# EAGLE design Girlfriend Tracker V0.2 (EAGLE 8.7.0)
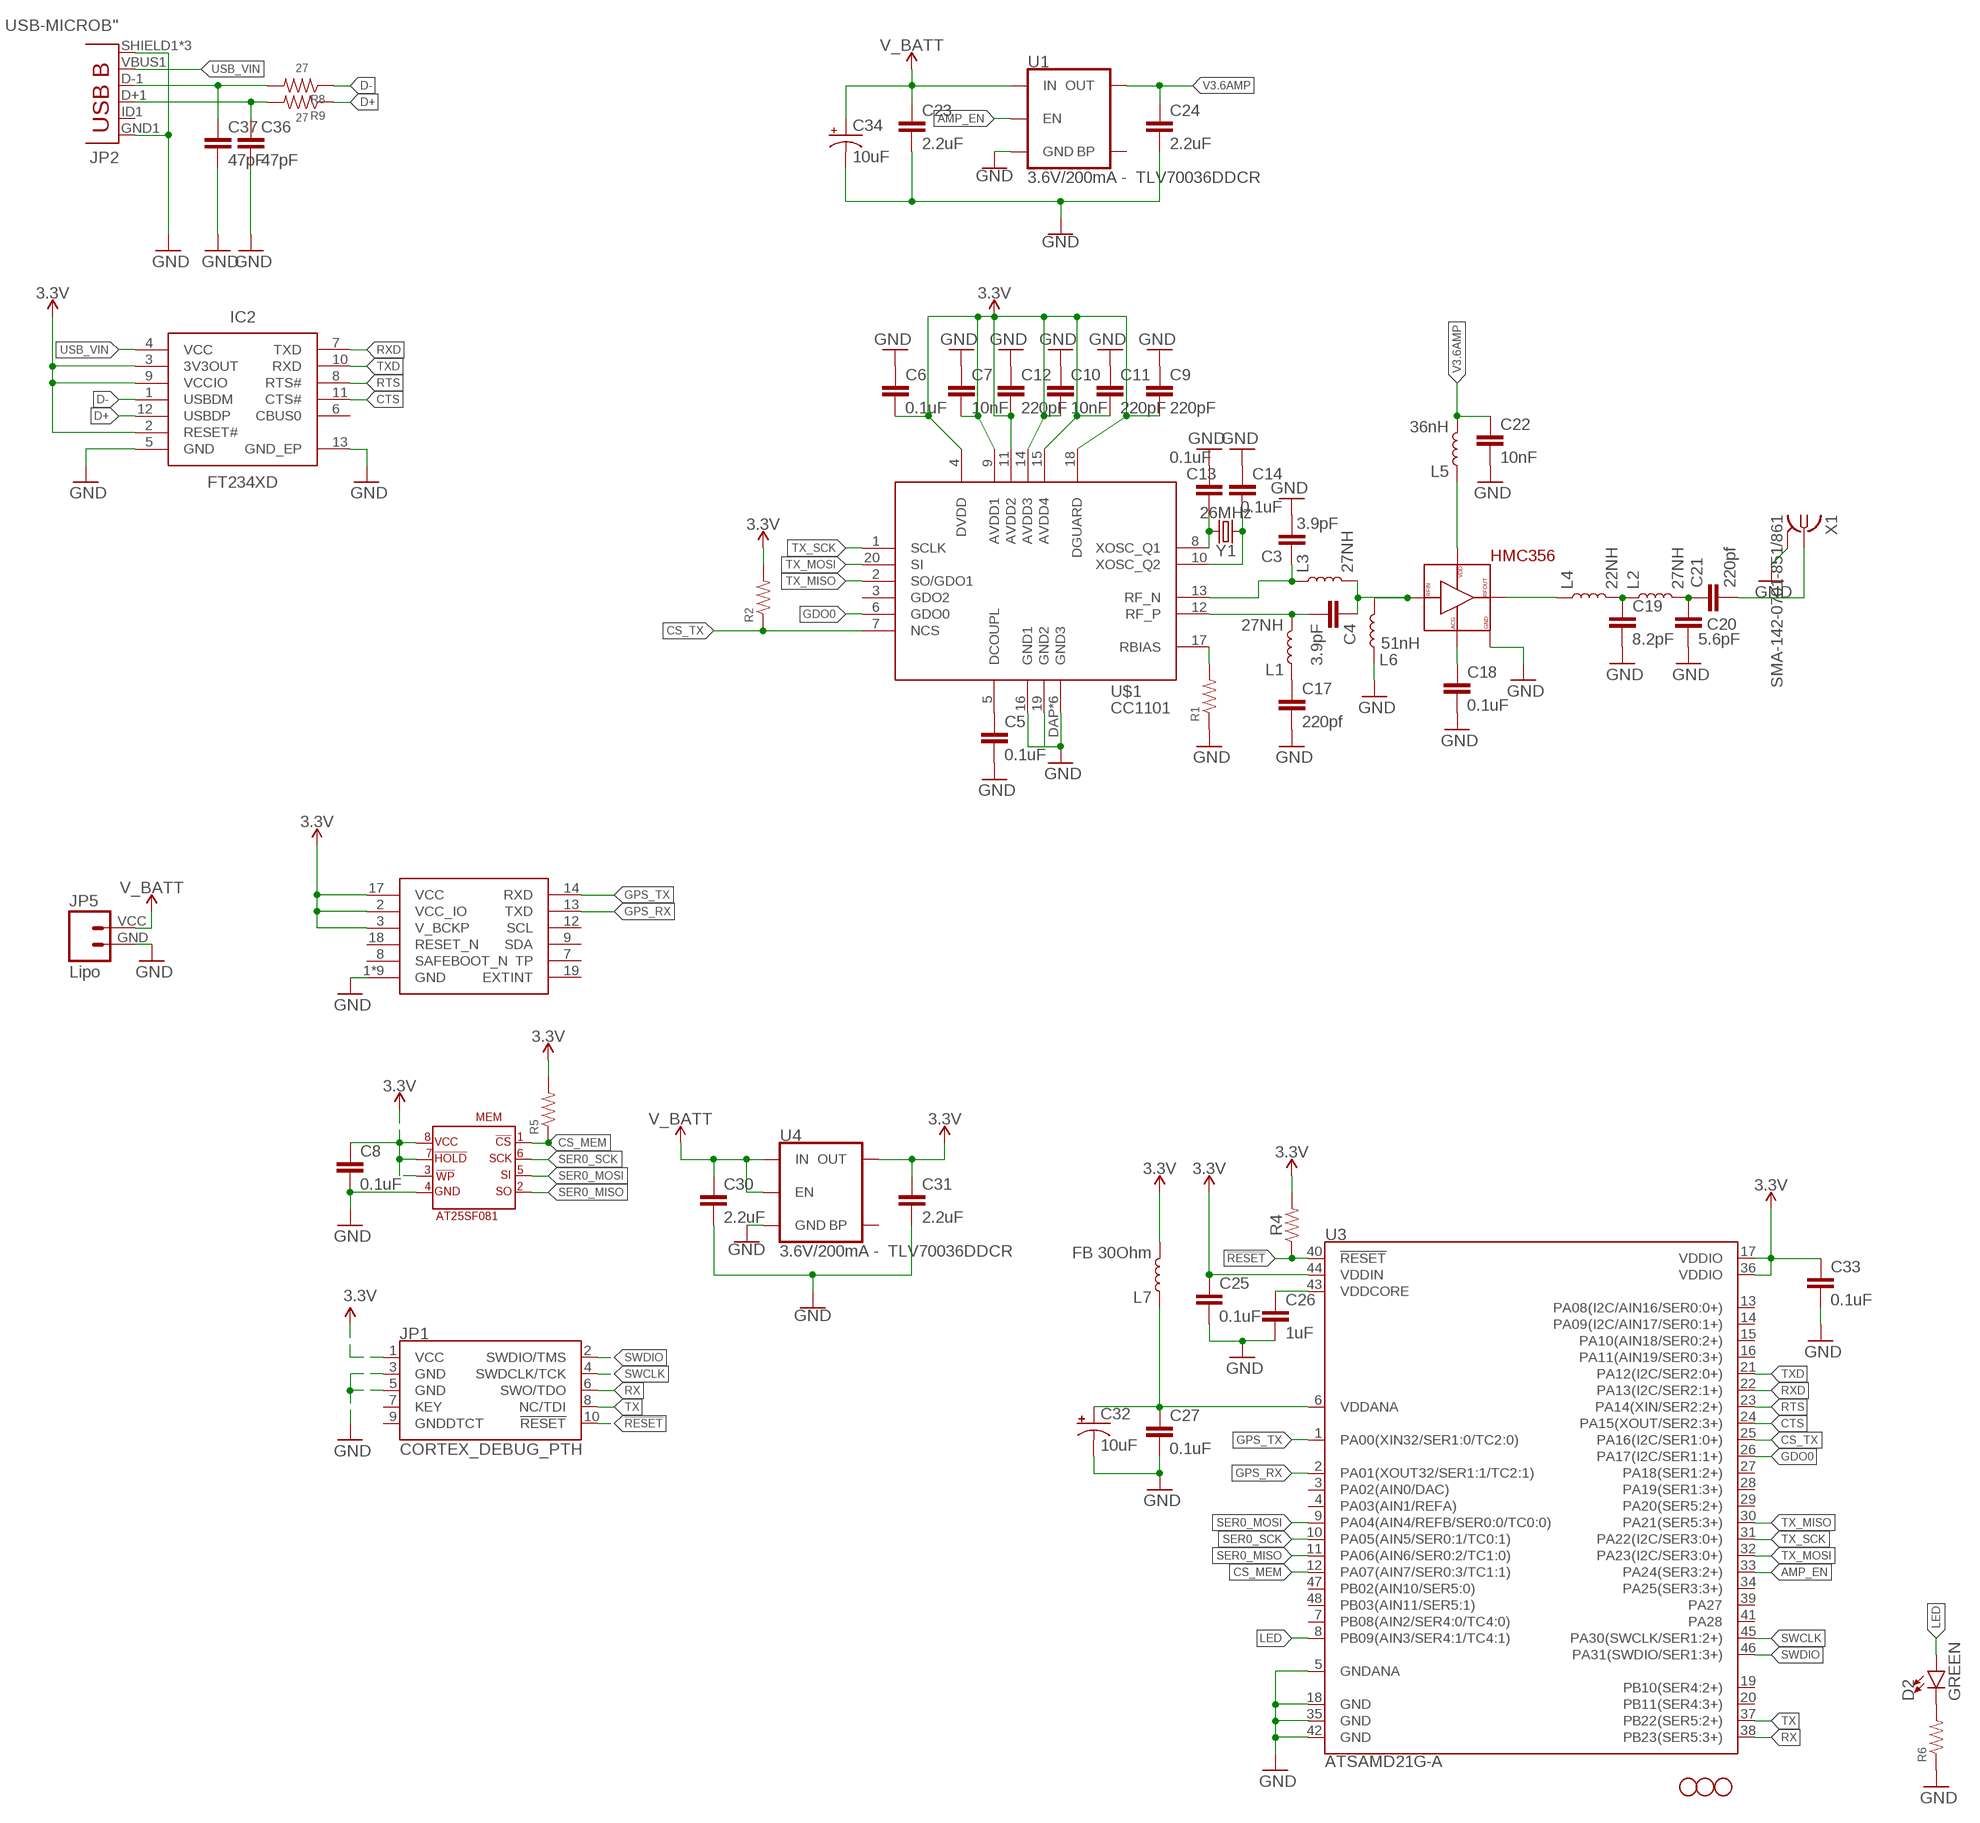
[diagram p0: schematic, sheet 1]

## Parts
C3  3.9pF  0.1UF-0402-16V-10%  [0402]
C4  3.9pF  0.1UF-0402-16V-10%  [0402]
C5  0.1uF  0.1UF-0402-16V-10%  [0402]
C6  0.1uF  0.1UF-0402-16V-10%  [0402]
C7  10nF  0.1UF-0402-16V-10%  [0402]
C8  0.1uF  0.1UF-0402-16V-10%  [0402]
C9  220pF  0.1UF-0402-16V-10%  [0402]
C10  10nF  0.1UF-0402-16V-10%  [0402]
C11  220pF  0.1UF-0402-16V-10%  [0402]
C12  220pF  0.1UF-0402-16V-10%  [0402]
C13  0.1uF  0.1UF-0402-16V-10%  [0402]
C14  0.1uF  0.1UF-0402-16V-10%  [0402]
C17  220pf  0.1UF-0402-16V-10%  [0402]
C18  0.1uF  0.1UF-0402-16V-10%  [0402]
C19  8.2pF  0.1UF-0402-16V-10%  [0402]
C20  5.6pF  0.1UF-0402-16V-10%  [0402]
C21  220pf  0.1UF-0402-16V-10%  [0402]
C22  10nF  0.1UF-0402-16V-10%  [0402]
C23  2.2uF  2.2UF-0603-10V-20%  [0603]
C24  2.2uF  2.2UF-0603-10V-20%  [0603]
C25  0.1uF  0.1UF-0402-16V-10%  [0402]
C26  1uF  0.1UF-0402-16V-10%  [0402]
C27  0.1uF  0.1UF-0402-16V-10%  [0402]
C30  2.2uF  2.2UF-0603-10V-20%  [0603]
C31  2.2uF  2.2UF-0603-10V-20%  [0603]
C32  10uF  CAP_POL1206  [EIA3216]
C33  0.1uF  0.1UF-0402-16V-10%  [0402]
C34  10uF  CAP_POL1206  [EIA3216]
C36  47pF  0.1UF-0402-16V-10%  [0402]
C37  47pF  0.1UF-0402-16V-10%  [0402]
D2  GREEN  LED-GREEN1206  [LED-1206]
H1  STAND-OFFTIGHT  [STAND-OFF-TIGHT]
H2  STAND-OFFTIGHT  [STAND-OFF-TIGHT]
H3  STAND-OFFTIGHT  [STAND-OFF-TIGHT]
IC1  SAM-M8Q  [SAM-M8Q]
IC2  FT234XD  [SON45P300X300X80-13N]
JP1  CORTEX_DEBUG_PTH  [2X5-PTH-1.27MM]
JP2  USB-MICROB"  [USB-B-MICRO-SMD_V03]
JP5  Lipo  M024UCON-15767  [JST-2-SMD-VERT]
L1  27NH  INDUCTOR-0402-3.9NH  [0402]
L2  27NH  INDUCTOR-0402-3.9NH  [0402]
L3  27NH  INDUCTOR-0402-3.9NH  [0402]
L4  22NH  INDUCTOR-0402-3.9NH  [0402]
L5  36nH  INDUCTOR-0402-3.9NH  [0402]
L6  51nH  INDUCTOR-0402-3.9NH  [0402]
L7  FB 30Ohm  INDUCTOR-0603-33NH  [0603]
MEM  AT25SF081  [AT25SF081]
R1  RESISTOR0402  [0402]
R2  RESISTOR0402  [0402]
R4  RESISTOR0402  [0402]
R5  RESISTOR0402  [0402]
R6  RESISTOR0402  [0402]
R8  27  RESISTOR0402  [0402]
R9  27  RESISTOR0402  [0402]
U1  3.6V/200mA - TLV70036DDCR  V_REG_MIC52053.3V  [SOT23-5]
U3  ATSAMD21G-A  [TQFP-48]
U4  3.6V/200mA - TLV70036DDCR  V_REG_MIC52053.3V  [SOT23-5]
U$1  CC1101  [CC1101]
U$3  HMC356  [QFN16_HMC356]
X1  SMA-142-0701-851/861  [J502-ND-142-0701-851/861]
Y1  26MHz  CRYSTALSMD-3.2X2.5  [CRYSTAL-SMD-3.2X2.5MM]

## Nets
3.3V: C6.2 C7.2 C8.1 C9.2 C10.2 C11.2 C12.2 C25.1 C31.1 C33.1 IC1.2(VCC_IO) IC1.3(V_BCKP) IC1.17(VCC) IC2.2(RESET#) IC2.3(3V3OUT) IC2.9(VCCIO) JP1.1(VCC) L7.2 MEM.!HOLD MEM.!WP MEM.VCC R2.2 R4.2 R5.2 U3.17(VDDIO) U3.36(VDDIO) U3.44(VDDIN) U4.5(OUT) U$1.4(DVDD) U$1.9(AVDD1) U$1.11(AVDD2) U$1.14(AVDD3) U$1.15(AVDD4) U$1.18(DGUARD)
!RESET: JP1.10(!RESET) R4.1 U3.40(!RESET!)
AMP_EN: U1.3(EN) U3.33(PA24(SER3:2+))
CS_MEM: MEM.!CS R5.1 U3.12(PA07(AIN7/SER0:3/TC1:1))
CS_TX: R2.1 U3.25(PA16(I2C/SER1:0+)) U$1.7(NCS)
CTS: IC2.11(CTS#) U3.24(PA15(XOUT/SER2:3+))
D+: IC2.12(USBDP) R9.1
D-: IC2.1(USBDM) R8.1
GDO0: U3.26(PA17(I2C/SER1:1+)) U$1.6(GDO0)
GND: C3.2 C5.2 C6.1 C7.1 C8.2 C9.1 C10.1 C11.1 C12.1 C13.1 C14.2 C17.2 C18.2 C19.2 C20.2 C22.2 C23.2 C24.2 C25.2 C26.2 C27.2 C30.2 C31.2 C32.C(-) C33.2 C34.C(-) C36.2 C37.2 IC1.1(GND) IC1.4(GND) IC1.5(GND) IC1.6(GND) IC1.10(GND) IC1.11(GND) IC1.15(GND) IC1.16(GND) IC1.20(GND) IC2.5(GND) IC2.13(GND_EP) JP1.3(GND) JP1.5(GND) JP2.GND1(GND) JP2.SHIELD1(SHIELD) JP2.SHIELD2(SHIELD) JP2.SHIELD3(SHIELD) JP5.GND L6.1 MEM.GND R1.1 R6.1 U1.2(GND) U3.5(GNDANA) U3.18(GND) U3.35(GND) U3.42(GND) U4.2(GND) U$1.16(GND1) U$1.19(GND2) U$1.DAP(GND3) U$1.P$1(GND3) U$1.P$2(GND3) U$1.P$3(GND3) U$1.P$4(GND3) U$1.P$5(GND3) U$3.P$2 U$3.P$4 U$3.P$6 U$3.P$16 U$3.P$17 U$3.P$17_1 U$3.P$17_2 U$3.P$17_3 U$3.P$17_4 X1.G@1 X1.G@2 X1.G@3 X1.G@4
GPS_RX: IC1.13(TXD) U3.2(PA01(XOUT32/SER1:1/TC2:1))
GPS_TX: IC1.14(RXD) U3.1(PA00(XIN32/SER1:0/TC2:0))
LED: D2.A U3.8(PB09(AIN3/SER4:1/TC4:1))
N$1: C17.1 L1.1
N$2: C36.1 JP2.D+1(D+) R9.2
N$3: C19.1 L2.1 L4.2
N$4: C13.2 U$1.8(XOSC_Q1) Y1.3
N$5: C20.1 C21.1 L2.2
N$6: C5.1 U$1.5(DCOUPL)
N$7: R1.2 U$1.17(RBIAS)
N$8: C18.1 U$3.P$7
N$9: C21.2 X1.1
N$10: L5.1 U$3.P$15
N$11: C4.1 L3.2 L6.2 U$3.P$3
N$12: C26.1 U3.43(VDDCORE)
N$13: C27.1 C32.A(+) L7.1 U3.6(VDDANA)
N$16: L4.1 U$3.P$11
N$17: C37.1 JP2.D-1(D-) R8.2
N$20: C14.1 U$1.10(XOSC_Q2) Y1.1
N$29: D2.C R6.2
RF_N: C3.1 L3.1 U$1.13(RF_N)
RF_P: C4.2 L1.2 U$1.12(RF_P)
RTS: IC2.8(RTS#) U3.23(PA14(XIN/SER2:2+))
RX: JP1.6(SWO/TDO) U3.38(PB23(SER5:3+))
RXD: IC2.7(TXD) U3.22(PA13(I2C/SER2:1+))
SER0_MISO: MEM.SO U3.11(PA06(AIN6/SER0:2/TC1:0))
SER0_MOSI: MEM.SI U3.9(PA04(AIN4/REFB/SER0:0/TC0:0))
SER0_SCK: MEM.SCK U3.10(PA05(AIN5/SER0:1/TC0:1))
SWCLK: JP1.4(SWDCLK/TCK) U3.45(PA30(SWCLK/SER1:2+))
SWDIO: JP1.2(SWDIO/TMS) U3.46(PA31(SWDIO/SER1:3+))
TX: JP1.8(NC/TDI) U3.37(PB22(SER5:2+))
TX_MISO: U3.30(PA21(SER5:3+)) U$1.2(SO/GDO1)
TX_MOSI: U3.32(PA23(I2C/SER3:0+)) U$1.20(SI)
TX_SCK: U3.31(PA22(I2C/SER3:0+)) U$1.1(SCLK)
TXD: IC2.10(RXD) U3.21(PA12(I2C/SER2:0+))
USB_VIN: IC2.4(VCC) JP2.VBUS1(VBUS)
V3.6AMP: C22.1 C24.1 L5.2 U1.5(OUT)
V_BATT: C23.1 C30.1 C34.A(+) JP5.VCC U1.1(IN) U4.1(IN) U4.3(EN)
Unconnected: IC1.7(TP) IC1.8(SAFEBOOT_N) IC1.9(SDA) IC1.12(SCL) IC1.18(RESET_N) IC1.19(EXTINT) IC2.6(CBUS0) JP1.7(KEY) JP1.9(GNDDTCT) JP2.ID1(USBID) U1.4(BP) U3.3(PA02(AIN0/DAC)) U3.4(PA03(AIN1/REFA)) U3.7(PB08(AIN2/SER4:0/TC4:0)) U3.13(PA08(I2C/AIN16/SER0:0+)) U3.14(PA09(I2C/AIN17/SER0:1+)) U3.15(PA10(AIN18/SER0:2+)) U3.16(PA11(AIN19/SER0:3+)) U3.19(PB10(SER4:2+)) U3.20(PB11(SER4:3+)) U3.27(PA18(SER1:2+)) U3.28(PA19(SER1:3+)) U3.29(PA20(SER5:2+)) U3.34(PA25(SER3:3+)) U3.39(PA27) U3.41(PA28) U3.47(PB02(AIN10/SER5:0)) U3.48(PB03(AIN11/SER5:1)) U4.4(BP) U$1.3(GDO2)

## Library data of the parts
C3 C4 C7 C9-C12 C17 C19-C22 C26 C36 C37 = SparkFun-Capacitors:0.1UF: 0.1µF ceramic capacitors A capacitor is a passive two-terminal electrical component used to store electrical energy temporarily in an electric field.; PROD_ID: CAP-12416; VALUE: 0.1uF
C5 C6 C8 C13 C14 C18 C25 C27 C33 = SparkFun-Capacitors:0.1UF: 0.1µF ceramic capacitors A capacitor is a passive two-terminal electrical component used to store electrical energy temporarily in an electric field.; PROD_ID: CAP-12416
C23 C24 C30 C31 = SparkFun-Capacitors:2.2UF: 2.2µF ceramic capacitors A capacitor is a passive two-terminal electrical component used to store electrical energy temporarily in an electric field.; PROD_ID: CAP-07888
C32 C34 = SparkFun:CAP_POL: Capacitor Polarized These are standard SMD and PTH capacitors. Normally 10uF, 47uF, and 100uF in electrolytic and tantalum varieties. Always verify the external diameter of the through hole cap, it varies with capacity, voltage, and manufacturer. The EIA devices should be standard.
D2 = SparkFun-LED:LED-GREEN: Green SMD LED Used in manufacturing of various products at SparkFun Packages: 0603 - SMD 0603 package [Product Link] <http://www.futureelectronics.com/en/technologies/semiconductors/optoelectronics/leds/Pages/9894312-LTST-C190GKT.aspx?CrossPart=HSMG-C190&IM=0> LilyPad 1206 - SMD1206 LilyPad package [Product Link] <http://www.futureelectronics.com/en/Technologies/Product.aspx?ProductID=IN150NGHARVATEKCORPORATION2049943&IM=0> 1206 - SMD1206 package [Product Link] <http://www.futureelectronics.com/en/technologies/semiconductors/optoelectronics/leds/Pages/8315665-LTST-C150KGKT.aspx?IM=0> 1206 Bottom Mount -SMD 1206 Bottom Mount [Product Link] <http://www.digikey.com/product-detail/en/lite-on-inc/LTST-C230KGKT/160-1456-1-ND/386854> SparkFun Products: Pro Mini 328 -5V <https://www.sparkfun.com/products/821> RedBoard <https://www.sparkfun.com/products/12757> MP3 Trigger <https://www.sparkfun.com/products/13720> Makey Makey <https://www.sparkfun.com/products/11076>; PROD_ID: DIO-00862
H1-H3 = SparkFun-Hardware:STAND-OFF: Stand Off Drill holes for mechanically mounting via screws, standoffs, etc. Note: Use the keepout ring to avoid running the screw head into surrounding components. Variant Overviews STAND-OFF - Mechanical footprint for a #4 phillips button head screw. STAND-OFF-TIGHT - Mechanical footprint for a #4 phillips button head screw, Example SparkFun Products Screw - Phillips Head (1/4", 4-40, 10 pack) <https://www.sparkfun.com/products/10453> (PRT-10453) Screw - Phillips Head (1/2", 4-40, 10 pack) <https://www.sparkfun.com/products/10452> (PRT-10452) Screw - Phillips Head (3/4", 4-40, 10 pack) <https://www.sparkfun.com/products/10451> (PRT-10451) Screw - Phillips Head (1", 4-40, 10 pack) <https://www.sparkfun.com/products/10450> (PRT-10450)
IC1 = ubloxLib:SAM-M8Q: u-blox SAM GNSS antenna module
IC2 = ft234xd:FT234XD: USB to serial UART Source: Datasheet <http://www.ftdichip.com/Support/Documents/DataSheets/ICs/DS_FT234XD.pdf>; DESCRIPTION: USB to serial UART; HEIGHT: 0.8mm; MANUFACTURER_NAME: FTDI Chip; MANUFACTURER_PART_NUMBER: ft234xd; SUPPLIER_NAME: RS
JP1 = SparkFun-Connectors:CORTEX_DEBUG: Cortex Debug Connector - 10 pin Supports JTAG debug, Serial Wire debug, and Serial Wire Viewer. PTH and SMD connector options available. General Connector Information <http://infocenter.arm.com/help/topic/com.arm.doc.faqs/attached/13634/cortex_debug_connectors.pdf> Products: PTH Connector <http://www.digikey.com/product-detail/en/cnc-tech/3220-10-0100-00/1175-1627-ND/3883661> -via Digi-Key SparkFun PSoc <https://www.sparkfun.com/products/13229> SparkFun T <https://www.sparkfun.com/products/13810>
JP2 = SparkFun-Connectors:USB-MICROB; PROD_ID: CONN-11752
JP5 = SparkFun-Connectors:M02: Standard 2-pin 0.1" header. Use with - straight break away headers ( PRT-00116) - right angle break away headers (PRT-00553) - swiss pins (PRT-00743) - machine pins (PRT-00117) - female headers (PRT-00115) Molex polarized connector foot print use with: PRT-08233 with associated crimp pins and housings. 2.54_SCREWTERM for use with PRT-10571. 3.5mm Screw Terminal footprints for PRT-08084 5mm Screw Terminal footprints for use with PRT-08432
L1-L6 = SparkFun-Coils:INDUCTOR: Inductors Resist changes in electrical current. Basically a coil of wire. SparkFun Products: SparkFun Load Cell Amplifier - HX711 <https://www.sparkfun.com/products/13879> IOIO-OTG - V2.2 <https://www.sparkfun.com/products/13613>; PROD_ID: NDUC-13457; VALUE: 3.9NH
L7 = SparkFun-Coils:INDUCTOR: Inductors Resist changes in electrical current. Basically a coil of wire. SparkFun Products: SparkFun Load Cell Amplifier - HX711 <https://www.sparkfun.com/products/13879> IOIO-OTG - V2.2 <https://www.sparkfun.com/products/13613>; PROD_ID: NDUC-07874; VALUE: 33nH/±5%/500mA
MEM = SaL-lib:AT25SF081: AT25SF081 - 8M memory smd
R1 R2 R4-R6 R8 R9 = SparkFun-Resistors:RESISTOR: Generic Resistor Package
U1 U4 = SparkFun-IC-Power:V_REG_MIC5205: V_REG MIC5205 Standard 3.3V, 5V, and Adjustable 150mA LDO voltage regulator in SOT-23 layout. Micrel part MIC5205. BP (by-pass) pin is used to lower output noise with 470pF cap, may be left open. On the adjustable version BP is used to set output.; PROD_ID: VREG-00822; VALUE: 3.3V/150mA
U3 = SparkFun-IC-Microcontroller:ATSAMD21G: Atmel SAMD21G SMART ARM-Based Microcontroller The Atmel ® | SMART ™ SAM D21 is a series of low-power microcontrollers using the 32-bit ARM ® Cortex ® -M0+ processor, and ranging from 32- to 64-pins with up to 256KB Flash and 32KB of SRAM. The SAM D21 devices operate at a maximum frequency of 48MHz and reach 2.46 CoreMark/MHz. They are designed for simple and intuitive migration with identical peripheral modules, hex compatible code, identical linear address map and pin compatible migration paths between all devices in the product series. All devices include intelligent and flexible peripherals, Atmel Event System for inter-peripheral signaling, and support for capacitive touch button, slider and wheel user interfaces. Datasheet <https://cdn.sparkfun.com/datasheets/Dev/Arduino/Boards/Atmel-42181-SAM-D21_Datasheet.pdf> SparkFun Products SparkFun SAMD21 Mini Breakout <https://www.sparkfun.com/products/13664> (DEV-13664) SparkFun SAMD21 Dev Breakout <https://www.sparkfun.com/products/13672> (DEV-13672); PROD_ID: IC-13064
U$1 = SaL-lib1:CC1101
U$3 = SaL-lib1:HMC356
X1 = con-coax:SMA-: SMA 50 Ohm End Launch Jack Receptacle - Round Contact Johnson Components Source: www.johnsoncomponents.com .. J502-ND.pdf; MF: JOHNSON COMPONENTS; MPN: 142-0701-851; OC_FARNELL: 1019325; OC_NEWARK: 99F6798
Y1 = SparkFun-Clocks:CRYSTAL: Crystals (Generic) These are passive quartz crystals, which can be used as a clock source for a microcontroller. Crystal's are two-terminal devices. They require external "load" capacitors to generate an oscillating signal.

## Net classes
1 power: width 0.254 mm

## Board
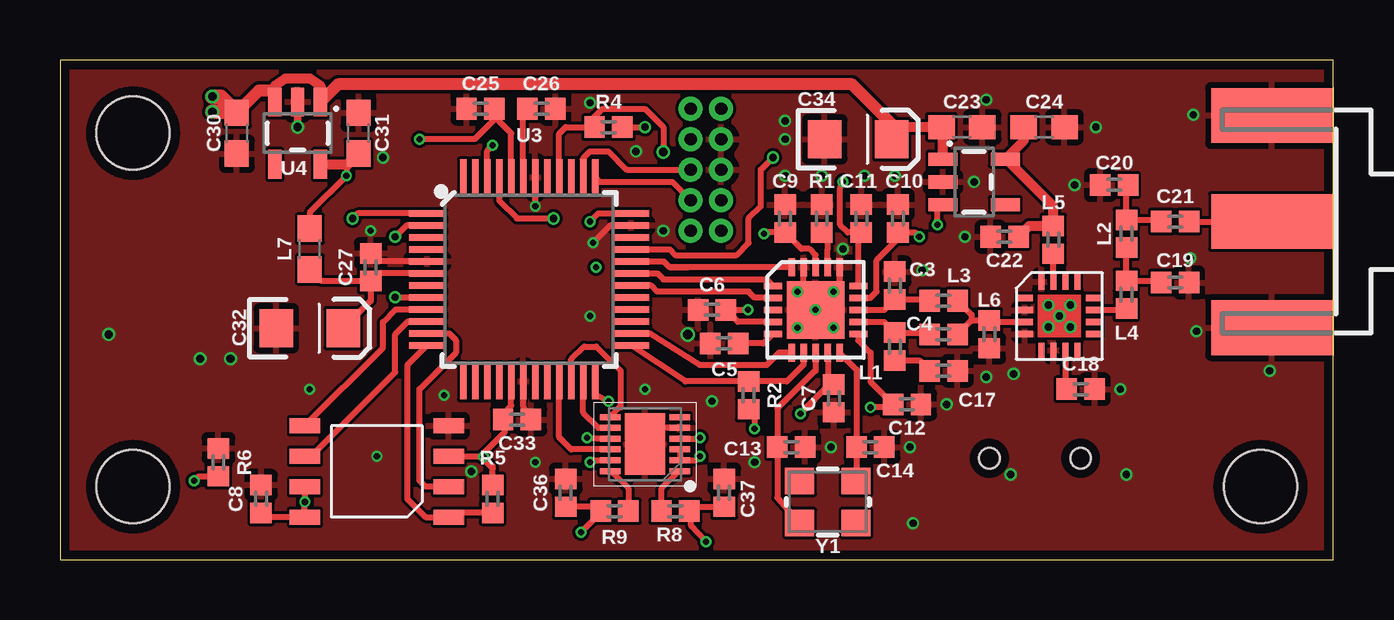
[diagram p1: board, top side]
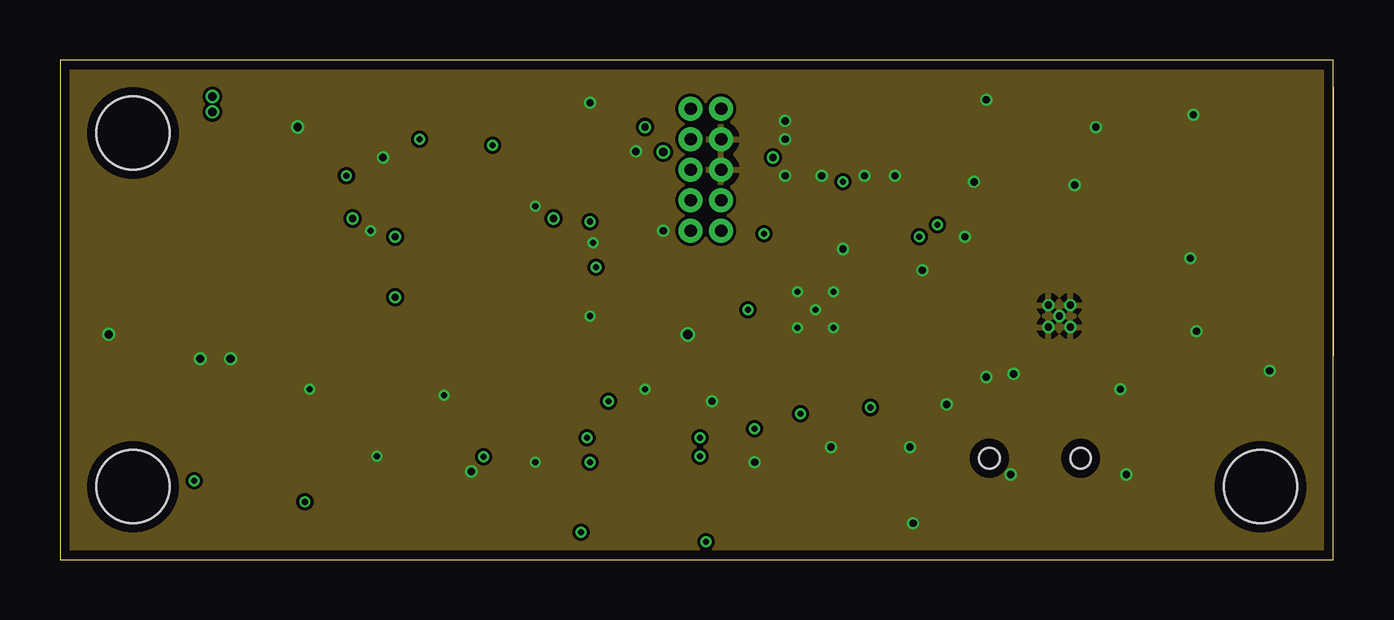
[diagram p2: board, inner layer Route2]
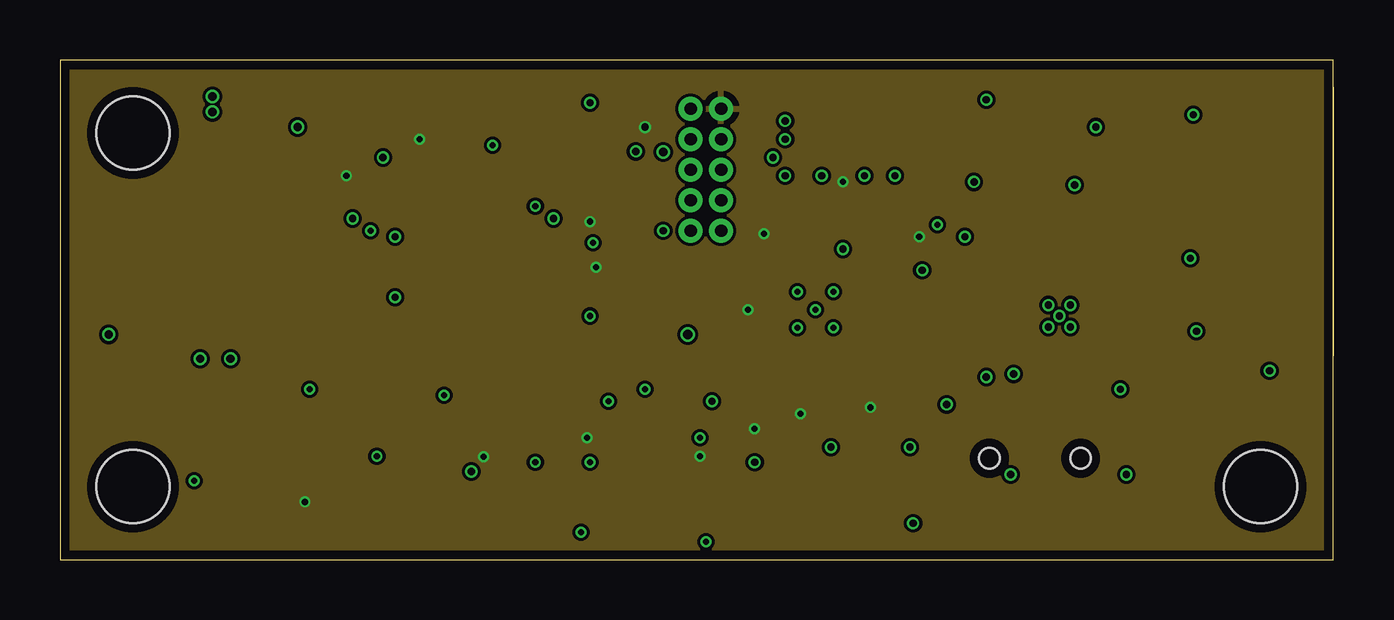
[diagram p3: board, inner layer Route15]
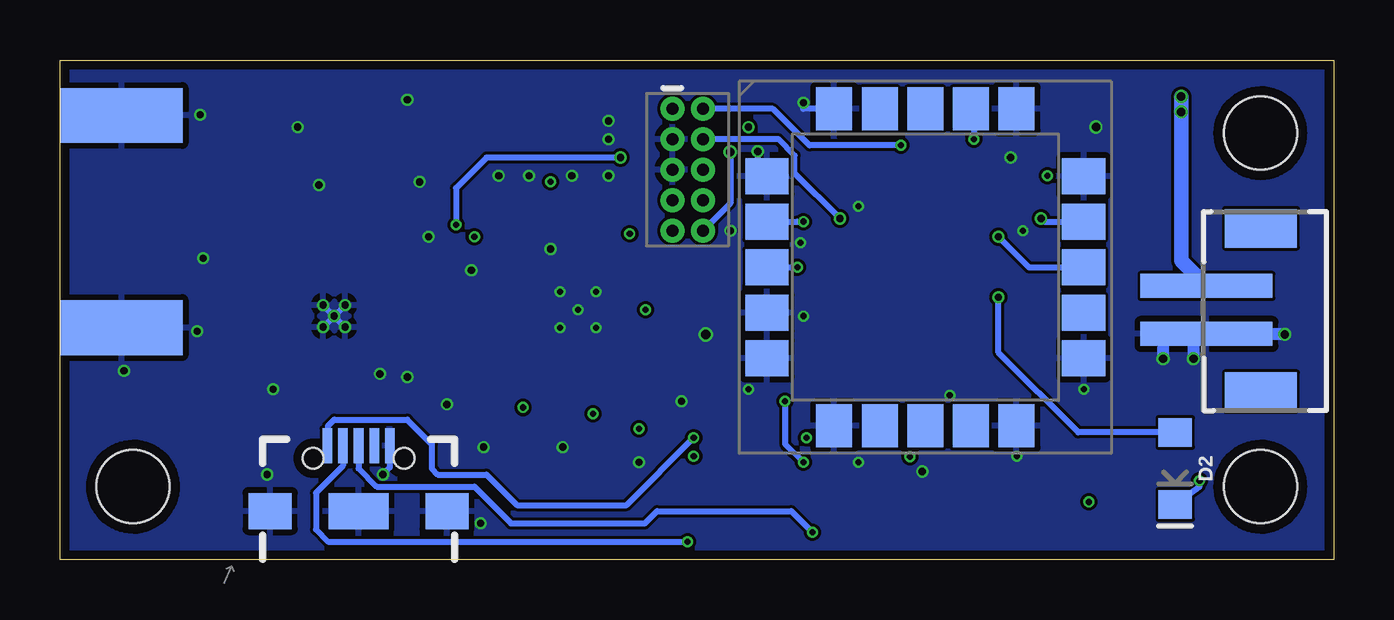
[diagram p4: board, bottom side, seen from below]

Size 53.09 x 20.83 mm. Coordinates in mm from the lower left corner, seen from the top.
Outline: 0,0 53.07,0 53.07,20.83 0,20.83 0,0
Copper layers (1*2*15*16): Top 0.035559375mm / dielectric 0.17018125mm / Route2 0.01778125mm / dielectric 47mil / Route15 0.01778125mm / dielectric 0.17018125mm / Bottom 0.035559375mm
Design rules "oshpark-4layer-tented *": minimum track width 5mil, minimum drill 10mil, track to track 5mil, track to pad 5mil, pad to pad 5mil, via to via 5mil, smd to smd 5mil, copper to edge 15mil, drill to drill 6mil, minimum pad ring 4mil, minimum via ring 4mil, stop-mask expansion 0mil, vias tented up to drill 20mil, thermal gap 10mil

### Footprints (pad centres in the part's own frame; a part is rotated, then mirrored left to right if it is on the bottom)
0402 = smd 0.85 x 0.9: 1 -0.58,0; 2 0.58,0
0603 = smd 1.1 x 1: 1 -0.85,0; 2 0.85,0
EIA3216 = smd 1.4 x 1.6: A 1.4,0; C -1.4,0
LED-1206 = smd 1.2 x 1.4: A -1.5,0; C 1.5,0
STAND-OFF-TIGHT = hole 3.048: 0,0
SAM-M8Q = smd 1.8 x 1.5: 1 -6.6,3.8; 2 -6.6,1.9; 3 -6.6,0; 4 -6.6,-1.9; 5 -6.6,-3.8; 11 6.6,-3.8; 12 6.6,-1.9; 13 6.6,0; 14 6.6,1.9; 15 6.6,3.8 | smd 1.5 x 1.8: 6 -3.8,-6.6; 7 -1.9,-6.6; 8 0,-6.6; 9 1.9,-6.6; 10 3.8,-6.6; 16 3.8,6.6; 17 1.9,6.6; 18 0,6.6; 19 -1.9,6.6; 20 -3.8,6.6
SON45P300X300X80-13N = smd 0.85 x 0.25: 1 -1.45,1.125; 2 -1.45,0.675; 3 -1.45,0.225; 4 -1.45,-0.225; 5 -1.45,-0.675; 6 -1.45,-1.125; 7 1.45,-1.125; 8 1.45,-0.675; 9 1.45,-0.225; 10 1.45,0.225; 11 1.45,0.675; 12 1.45,1.125 | smd 1.65 x 2.55: 13 0,0
2X5-PTH-1.27MM = drill 0.508 pad 1: 1 -2.54,-0.635; 2 -2.54,0.635; 3 -1.27,-0.635; 4 -1.27,0.635; 5 0,-0.635; 6 0,0.635; 7 1.27,-0.635; 8 1.27,0.635; 9 2.54,-0.635; 10 2.54,0.635
USB-B-MICRO-SMD_V03 = smd 1.45 x 0.4: D+1 2.725,0; D-1 2.725,0.65; GND1 2.725,-1.3; ID1 2.725,-0.65; VBUS1 2.725,1.3 | smd 1.5 x 1.8: SHIELD1 0,3.685; SHIELD2 0,-3.685 | smd 1.5 x 2.5: SHIELD3 0,0 | hole 0.85: 2.2,1.9; 2.2,-1.9
JST-2-SMD-VERT = smd 1 x 5.5: GND 1,-2; VCC -1,-2 | smd 1.6 x 3: P$1 -3.4,0.27; P$2 3.4,0.27
AT25SF081 = smd 1.27 x 0.635: !CS -3,2.54; !HOLD 3,1.27; !WP -3,0; GND -3,-1.27; SCK 3,0; SI 3,-1.27; SO -3,1.27; VCC 3,2.54
SOT23-5 = smd 0.55 x 1.2: 1 -0.95,-1.3; 2 0,-1.3; 3 0.95,-1.3; 4 0.95,1.3; 5 -0.95,1.3
TQFP-48 = smd 1.5 x 0.28: 1 -4.25,2.75; 2 -4.25,2.25; 3 -4.25,1.75; 4 -4.25,1.25; 5 -4.25,0.75; 6 -4.25,0.25; 7 -4.25,-0.25; 8 -4.25,-0.75; 9 -4.25,-1.25; 10 -4.25,-1.75; 11 -4.25,-2.25; 12 -4.25,-2.75; 25 4.25,-2.75; 26 4.25,-2.25; 27 4.25,-1.75; 28 4.25,-1.25; 29 4.25,-0.75; 30 4.25,-0.25; 31 4.25,0.25; 32 4.25,0.75; 33 4.25,1.25; 34 4.25,1.75; 35 4.25,2.25; 36 4.25,2.75 | smd 0.28 x 1.5: 13 -2.75,-4.25; 14 -2.25,-4.25; 15 -1.75,-4.25; 16 -1.25,-4.25; 17 -0.75,-4.25; 18 -0.25,-4.25; 19 0.25,-4.25; 20 0.75,-4.25; 21 1.25,-4.25; 22 1.75,-4.25; 23 2.25,-4.25; 24 2.75,-4.25; 37 2.75,4.25; 38 2.25,4.25; 39 1.75,4.25; 40 1.25,4.25; 41 0.75,4.25; 42 0.25,4.25; 43 -0.25,4.25; 44 -0.75,4.25; 45 -1.25,4.25; 46 -1.75,4.25; 47 -2.25,4.25; 48 -2.75,4.25
CC1101 = smd 0.76 x 0.28: 1 -1.78,1; 2 -1.78,0.5; 3 -1.78,0; 4 -1.78,-0.5; 5 -1.78,-1; 11 1.78,-1; 12 1.78,-0.5; 13 1.78,0; 14 1.78,0.5; 15 1.78,1 | smd 0.28 x 0.76: 6 -1,-1.78; 7 -0.5,-1.78; 8 0,-1.78; 9 0.5,-1.78; 10 1,-1.78; 16 1,1.78; 17 0.5,1.78; 18 0,1.78; 19 -0.5,1.78; 20 -1,1.78 | smd 2.4 x 2.4: DAP 0,0 | drill 0.254 pad 0.457: P$1 -0.75,0.75; P$2 0.75,0.75; P$3 0.75,-0.75; P$4 -0.75,-0.75; P$5 0,0
QFN16_HMC356 = smd 0.66 x 0.254: P$1 -1.435,0.75; P$2 -1.435,0.25; P$3 -1.435,-0.25; P$4 -1.435,-0.75; P$9 1.435,-0.75; P$10 1.435,-0.25; P$11 1.435,0.25; P$12 1.435,0.75 | smd 0.254 x 0.66: P$5 -0.75,-1.435; P$6 -0.25,-1.435; P$7 0.25,-1.435; P$8 0.75,-1.435; P$13 0.75,1.435; P$14 0.25,1.435; P$15 -0.25,1.435; P$16 -0.75,1.435 | drill 0.3 pad 0.406: P$17 0,0; P$17_1 0.457,0.457; P$17_2 -0.457,0.457; P$17_3 -0.457,-0.457; P$17_4 0.457,-0.457
J502-ND-142-0701-851/861 = smd 5.08 x 2.286: 1 2.565,0; G@1 2.565,4.42; G@2 2.565,-4.42 | smd 5.08 x 2.286 bottom: G@3 2.565,4.42; G@4 2.565,-4.42
CRYSTAL-SMD-3.2X2.5MM = smd 1.2 x 1.1: 1 -1.175,-0.875; 2 1.175,-0.875; 3 1.175,0.875; 4 -1.175,0.875

### Placement (x,y rotation side)
C3  34.8,11.43 90 top
C4  36.83,9.4 180 top
C5  27.69,9.02 180 top
C6  27.18,10.41 0 top
C7  32.26,6.73 90 top
C8  8.38,2.54 90 top
C9  30.23,14.22 270 top
C10  34.92,14.22 270 top
C11  33.4,14.22 270 top
C12  35.31,6.48 180 top
C13  30.48,4.7 180 top
C14  33.78,4.7 0 top
C17  36.83,7.87 0 top
C18  42.55,7.11 0 top
C19  46.48,11.56 0 top
C20  43.94,15.62 180 top
C21  46.48,14.1 0 top
C22  39.37,13.46 180 top
C23  37.59,18.03 0 top
C24  41.02,18.03 0 top
C25  17.53,18.8 180 top
C26  20.07,18.8 0 top
C27  12.95,12.19 90 top
C30  7.37,17.78 270 top
C31  12.45,17.78 90 top
C32  10.41,9.65 0 top
C33  19.05,5.84 0 top
C34  33.27,17.53 0 top
C36  21.08,2.79 90 top
C37  27.69,2.79 90 top
D2  6.6,3.81 270 bottom
H1  50.04,3.05 0 top
H2  3.05,3.05 0 top
H3  3.05,17.78 0 top
IC1  17.02,12.19 0 bottom
IC2  24.38,4.83 180 top
JP1  26.92,16.26 270 bottom
JP2  40.64,2.03 90 bottom
JP5  3.3,10.41 270 bottom
L1  34.8,8.89 90 top
L2  44.45,13.59 90 top
L3  36.83,10.79 0 top
L4  44.45,11.05 90 top
L5  41.4,13.34 90 top
L6  38.73,9.4 90 top
L7  10.41,12.95 90 top
MEM  13.21,4.32 180 top
R1  31.75,14.22 270 top
R2  28.7,6.86 270 top
R4  22.86,18.03 0 top
R5  18.03,2.54 90 top
R6  6.6,4.06 270 top
R8  25.65,2.03 0 top
R9  23.11,2.03 180 top
U1  38.1,15.75 270 top
U3  19.56,11.68 0 top
U4  9.91,17.78 180 top
U$1  31.5,10.41 0 top
U$3  41.66,10.16 0 top
X1  53.09,14.1 180 top
Y1  32,2.41 180 top

### Tracks (layer width: path | path; a pad name or v marks a point on that pad's centre or on a via)
3.3V  (via drill 0.25, 0.3)
  Top 0.254: U$1.14 33.77,10.91 34.04,11.18 34.04,12.48 34.92,13.37 C10.2 35.63,13.64 v35.81,13.46 | U$1.15 33.28,13.52 C11.2 32.84,13.64 32.51,13.97 32.51,15.49 v32.64,15.75 | U$1.9 32,7.57 C7.2 32.08,7.31 v30.86,6.1 31.37,6.6 | U$1.11 33.28,9.14 33.78,8.64 33.78,7.42 C12.2 34.6,6.35 v33.78,6.35 | U$1.18 31.5,12.7 31.24,12.95 30.92,12.95 C9.2 29.41,13.64 v29.34,13.59 | U$1.4 28.26,9.91 C6.2 v28.68,10.41 | R2.2 28.96,6.02 v28.96,5.46 | U3.44 18.81,17.77 18.11,18.47 C25.1 18.11,18.36 17.27,17.53 v14.99,17.53 | C8.1 8.56,1.78 MEM.VCC v10.21,2.41 MEM.!HOLD | C33.1 18.51,6.13 | 18.51,6.13 18.81,6.43 U3.17 | MEM.!WP 17.53,4.32 | 17.53,4.32 18.54,5.33 18.54,6.1 18.51,6.13 | 17.53,4.32 18.03,3.81 R5.2 18.03,3.91 v17.65,4.29 | v22.1,14.1 22.43,14.43 U3.36 | 12,16.48 11.94,16.42 v11.94,16 10.41,14.48 L7.2 | IC2.9 22.39,5.05 v21.97,5.08 | IC2.3 IC2.2 26.5,4.15 v26.67,4.32 | R4.2 v24.38,18.03
  Top 0.406: U4.5 12,16.48 C31.1
  Bottom 0.254: IC1.3 v22.35,12.19 | IC1.2 22.36,14.09 v22.1,14.1 | IC1.17 14.99,18.66 v14.99,17.53
  pour Route15: -2.79,-0.76 -2.79,24.38 54.61,24.38 54.61,-0.76
!RESET  (via drill 0.35)
  Top 0.254: U3.40 20.81,17.76 21.08,18.03 22.1,18.03 22.28,18.47 | R4.1 22.28,18.47 | v25.15,17 25.15,18.03 24.38,18.8 22.61,18.8 22.28,18.47
  Bottom 0.254: v25.15,17 25.15,14.86 JP1.10
AMP_EN  (via drill 0.25, 0.3)
  Top 0.254: v29.72,16.76 29.21,16.26 29.21,14.73 28.7,14.22 28.7,13.21 28.19,12.7 25.65,12.7 25.42,12.93 U3.33 | v36.58,13.97 36.58,14.57 U1.3
  Bottom 0.254: v29.72,16.76 35.31,16.76 36.58,15.49 v36.58,13.97
CS_MEM
  Top 0.254: R5.1 16.14,1.96 MEM.!CS 15.24,1.78 14.48,2.54 14.48,8.1 U3.12
CS_TX
  Top 0.254: U$1.7 31,8.14 30.3,7.44 R2.1 26.07,7.44 U3.25
CTS  (via drill 0.25)
  Top 0.254: U3.24 22.31,6.9 v22.86,6.6 | v22.1,4.06 22.18,4.15 IC2.11
  Bottom 0.254: v22.86,6.6 22.86,4.83 v22.1,4.06
D+
  Top 0.254: IC2.12 23.06,3.61 23.69,2.98 R9.1
D-
  Top 0.254: R8.1 25.07,2.98 25.8,3.7 IC2.1
GDO0
  Top 0.254: U$1.6 29.97,8.63 29.46,8.13 26.67,8.13 24.6,9.43 U3.26
GND  (via drill 0.25, 0.3, 0.35, 0.4)
  Top 0.254: U3.18 19.31,6.42 C33.2 | U3.5 13.29,12.43 C27.2 | U3.42 v19.81,14.73 | U3.35 22.95,13.93 v22.23,13.21 | IC2.5 24.8,5.5 24.38,5.08 IC2.13 | U$1.P$5 31,10.91 U$1.19 | U$1.16 32.5,11.41 U$1.P$2
  Top 0.305: U4.2 v9.91,18.03
  Bottom 0.254: IC1.20 22.1,18.79 v22.1,19.05 | JP2.GND1 39.34,3.84 v39.62,3.56 | v24,17.02 24,16.38 IC1.1 | U$3.P$17_4 U$3.P$17 | U$3.P$17_3 U$3.P$17 | U$3.P$17_2 U$3.P$17 | U$3.P$17_1 U$3.P$17
  Bottom 0.508: JP5.GND 5.84,9.13 v5.84,8.38 | JP5.GND 7.1,9.41 v7.11,8.38 | JP5.GND 2.05,9.41 v2.03,9.4
  other vias: 13.21,4.32 10.41,7.11 16,6.86 19.81,4.06 22.1,10.16 24.38,7.11 12.95,13.72 37.72,13.46 35.94,12.06 42.29,15.62 43.18,18.03 38.61,19.18 47.24,18.54 47.12,12.57 47.37,9.53 50.42,7.87 44.2,7.11 44.45,3.56 39.75,7.75 38.61,7.62 36.96,6.48 35.43,4.7 38.1,15.75 34.8,16 33.53,16 31.75,16 30.23,18.29 30.23,17.53 30.23,16 32.13,4.7 35.56,1.52 28.96,4.06 27.18,6.6 26.16,9.4 13.46,16.76 17.14,3.68 32.64,12.95 25.15,13.72
  pour Top: -0.76,0 -0.76,21.84 53.59,21.84 53.59,-0.76 -1.02,-0.76 -1.02,0
  pour Bottom: -1.78,-0.51 -1.78,22.86 54.61,22.86 54.61,-0.51
  pour Route2: -2.54,-0.76 54.61,-0.76 54.61,23.62 -2.54,23.62
GPS_RX  (via drill 0.3)
  Top 0.254: U3.2 14.44,13.93 v13.97,13.46
  Bottom 0.254: v13.97,13.46 12.7,12.19 IC1.13
GPS_TX  (via drill 0.3)
  Top 0.254: U3.1 12.4,14.43 v12.19,14.22
  Bottom 0.254: v12.19,14.22 12.06,14.09 IC1.14
LED  (via drill 0.3)
  Top 0.254: v13.97,10.94 U3.8
  Bottom 0.254: D2.A 10.64,5.31 13.97,8.64 v13.97,10.94
N$1
  Top 0.254: L1.1 35.81,8.31 C17.1
N$2  (via drill 0.25)
  Top 0.254: v21.72,1.14 22.53,1.96 R9.2 22.46,2.21 C36.1
  Bottom 0.254: JP2.D+1 40.64,3.81 39.88,3.05 35.81,3.05 34.29,1.52 28.7,1.52 28.19,2.03 22.61,2.03 v21.72,1.14
N$3
  Top 0.254: C19.1 45.83,11.63 L4.2 L2.1
N$4
  Top 0.254: Y1.3 29.9,2.59 C13.2 29.9,6.31 31.45,7.86 31.48,7.86 31.5,7.87 U$1.8
N$5
  Top 0.254: C21.1 45.83,14.17 L2.2 44.45,15.55 C20.1
N$6
  Top 0.254: U$1.5 29.32,9.02 C5.1
N$7
  Top 0.254: U$1.17 32,12.95 32,13.39 R1.2
N$8
  Top 0.254: U$3.P$7 41.91,7.17 C18.1
N$9
  Top 0.254: C21.2 X1.1
N$10
  Top 0.254: U$3.P$15 L5.1
N$11
  Top 0.254: C4.1 37.99,9.98 | 37.99,9.98 L6.2 38.8,9.91 U$3.P$3 | L3.2 37.99,10.21 37.99,9.98
N$12
  Top 0.254: U3.43 19.31,18.62 C26.1
N$13
  Top 0.254: U3.6 13.28,11.93 C27.1 | C27.1 12.95,10.79 C32.A | C27.1 10.91,11.61 L7.1
N$16
  Top 0.254: U$3.P$11 44.4,10.41 L4.1
N$17  (via drill 0.25)
  Top 0.254: R8.2 26.31,2.21 | 26.31,2.21 C37.1 | v26.92,0.76 26.31,1.41 26.31,2.21
  Bottom 0.254: JP2.D-1 41.29,3.92 42.42,2.79 42.42,1.27 41.91,0.76 v26.92,0.76
N$20
  Top 0.254: U$1.10 33.2,7.93 C14.1 33.2,3.44 Y1.1
N$29  (via drill 0.25)
  Top 0.254: v5.59,3.3 5.77,3.48 R6.2
  Bottom 0.254: D2.C 5.59,3.05 v5.59,3.3
RF_N
  Top 0.254: U$1.13 34.36,10.41 C3.1 36.2,10.85 L3.1
RF_P
  Top 0.254: U$1.12 34.35,9.91 L1.2 36.18,9.47 C4.2
RTS
  Top 0.254: IC2.8 22.44,5.5 21.81,6.13 U3.23
RX
  Top 0.254: U3.38 21.81,16.73 22.1,17.02 22.86,17.02 23.62,16.26 JP1.6
RXD
  Top 0.254: U3.22 21.31,8.35 21.84,8.89 22.35,8.89 23.37,7.87 23.37,6.35 23.33,6.35 IC2.7
SER0_MISO
  Top 0.254: U3.11 16.22,9.43 16.51,9.14 16.51,8.64 14.99,7.11 14.99,3.3 15.24,3.05 MEM.SO 15.7,3.05
SER0_MOSI
  Top 0.254: MEM.SI 13.46,8.84 13.46,9.91 13.99,10.43 U3.9
SER0_SCK
  Top 0.254: MEM.SCK 10.65,4.51 13.97,7.83 13.97,9.4 14.51,9.93 U3.10
SWCLK  (via drill 0.3)
  Top 0.254: U3.45 18.31,14.97 19.05,14.22 v20.57,14.22
  Bottom 0.254: v20.57,14.22 22.46,16.11 22.46,16.85 23.14,17.53 JP1.4
SWDIO  (via drill 0.25)
  Top 0.254: U3.46 17.81,17.05 v18.03,17.27
  Bottom 0.254: v18.03,17.27 21.84,17.27 23.37,18.8 JP1.2
TX
  Top 0.254: U3.37 22.49,15.75 25.53,15.75 JP1.8
TX_MISO
  Top 0.254: U$1.2 29.71,10.92 28.96,10.92 28.7,11.18 24.89,11.18 24.63,11.43 U3.30
TX_MOSI
  Top 0.254: U$1.20 25.4,12.19 | 25.4,12.19 26.16,12.19 | U3.32 25.16,12.43 25.4,12.19
TX_SCK
  Top 0.254: U3.31 24.9,11.93 25.15,11.68 29.45,11.68 U$1.1
TXD
  Top 0.254: IC2.10 21.31,4.6 20.81,5.1 U3.21
USB_VIN  (via drill 0.25)
  Top 0.254: IC2.4 26.64,5.05 v26.67,5.08
  Bottom 0.254: JP2.VBUS1 41.91,4.79 41.91,5.59 41.66,5.84 38.61,5.84 37.59,4.83 37.59,3.81 37.34,3.56 35.31,3.56 34.04,2.29 29.46,2.29 v26.67,5.08
V3.6AMP
  Top 0.406: U1.5 39.42,16.72 | 39.42,16.72 40.17,17.47 C24.1 | 39.42,16.72 41.4,14.73 L5.2 40.4,13.91 C22.1
V_BATT  (via drill 0.35)
  Top 0.406: U1.1 36.8,17.98 C23.1 35.18,18.03 C34.A | U4.3 8.96,19.56 8.96,19.75 9.4,20.07 10.41,20.07 10.86,19.75 U4.1
  Top 0.508: C34.A 34.67,18.16 33.02,19.81 11.59,19.81 U4.1 | C30.1 8.29,19.56 8.96,19.56
  Top 0.61: v6.35,19.3 6.69,19.3 C30.1 | v6.35,18.67 7.37,18.67
  Bottom 0.61: JP5.VCC 6.35,12.46 v6.35,18.67 v6.35,19.3